# EAGLE design Booster Capacitor (EAGLE 9.6.2)
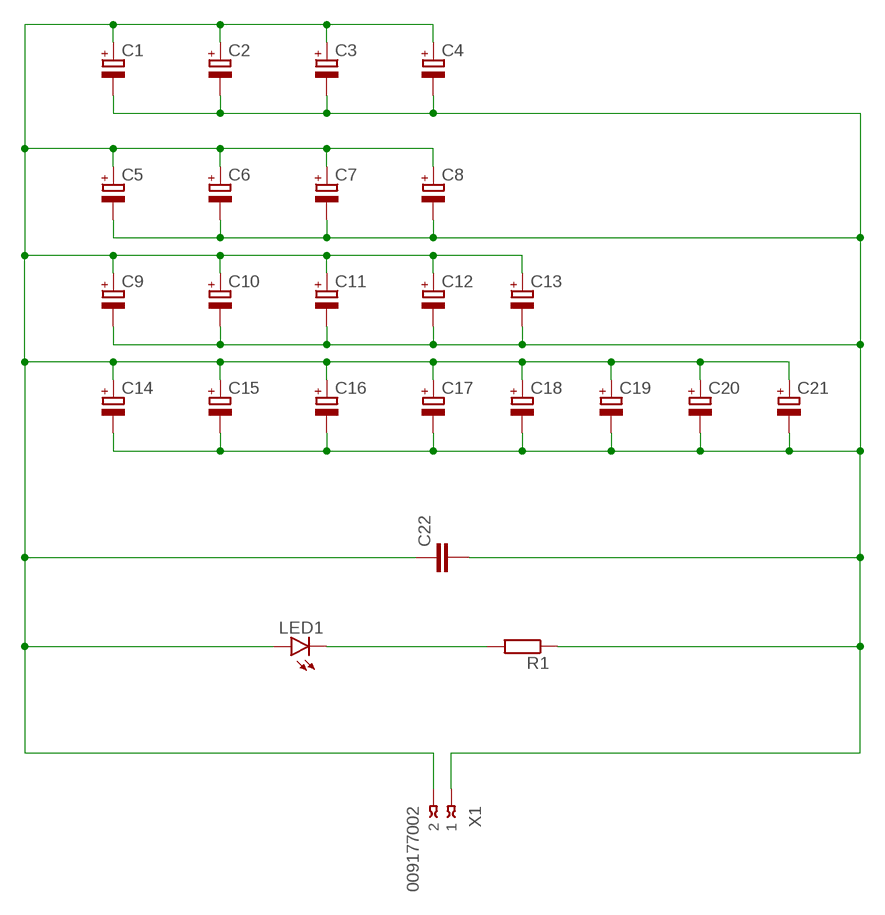
[diagram p0: schematic, sheet 1]

## Parts
C1  CPOL-EUE3.5-8  [E3,5-8]
C2  CPOL-EUE3.5-8  [E3,5-8]
C3  CPOL-EUE3.5-8  [E3,5-8]
C4  CPOL-EUE3.5-8  [E3,5-8]
C5  CPOL-EUE3.5-8  [E3,5-8]
C6  CPOL-EUE3.5-8  [E3,5-8]
C7  CPOL-EUE3.5-8  [E3,5-8]
C8  CPOL-EUE3.5-8  [E3,5-8]
C9  CPOL-EUE2.5-7  [E2,5-7]
C10  CPOL-EUE2.5-7  [E2,5-7]
C11  CPOL-EUE2.5-7  [E2,5-7]
C12  CPOL-EUE2.5-7  [E2,5-7]
C13  CPOL-EUE2.5-7  [E2,5-7]
C14  CPOL-EUE2.5-6  [E2,5-6]
C15  CPOL-EUE2.5-6  [E2,5-6]
C16  CPOL-EUE2.5-6  [E2,5-6]
C17  CPOL-EUE2.5-6  [E2,5-6]
C18  CPOL-EUE2.5-6  [E2,5-6]
C19  CPOL-EUE2.5-6  [E2,5-6]
C20  CPOL-EUE2.5-6  [E2,5-6]
C21  CPOL-EUE2.5-6  [E2,5-6]
C22  C-EU025-025X050  [C025-025X050]
LED1  LED5MM  [LED5MM]
R1  R-EU_0207/10  [0207/10]
X1  009177002  [009177002]

## Nets
N$1: LED1.K(C) R1.2
N$4: C1.+ C2.+ C3.+ C4.+ C5.+ C6.+ C7.+ C8.+ C9.+ C10.+ C11.+ C12.+ C13.+ C14.+ C15.+ C16.+ C17.+ C18.+ C19.+ C20.+ C21.+ C22.1 LED1.A X1.2
N$7: C1.- C2.- C3.- C4.- C5.- C6.- C7.- C8.- C9.- C10.- C11.- C12.- C13.- C14.- C15.- C16.- C17.- C18.- C19.- C20.- C21.- C22.2 R1.1 X1.1

## Library data of the parts
C1-C21 = rcl:CPOL-EU: POLARIZED CAPACITOR, European symbol; SPICEPREFIX: C
C22 = rcl:C-EU: CAPACITOR, European symbol; SPICEPREFIX: C
LED1 = led:LED: LED OSRAM: - CHIPLED LG R971, LG N971, LY N971, LG Q971, LY Q971, LO R971, LY R971 LH N974, LH R974 LS Q976, LO Q976, LY Q976 LO Q996 - Hyper CHIPLED LW Q18S LB Q993, LB Q99A, LB R99A - SideLED LS A670, LO A670, LY A670, LG A670, LP A670 LB A673, LV A673, LT A673, LW A673 LH A674 LY A675 LS A676, LA A676, LO A676, LY A676, LW A676 LS A679, LY A679, LG A679 - Hyper Micro SIDELED® LS Y876, LA Y876, LO Y876, LY Y876 LT Y87S - SmartLED LW L88C, LW L88S LB L89C, LB L89S, LG L890 LS L89K, LO L89K, LY L89K LS L896, LA L896, LO L896, LY L896 - TOPLED LS T670, LO T670, LY T670, LG T670, LP T670 LSG T670, LSP T670, LSY T670, LOP T670, LYG T670 LG T671, LOG T671, LSG T671 LB T673, LV T673, LT T673, LW T673 LH T674 LS T676, LA T676, LO T676, LY T676, LB T676, LH T676, LSB T676, LW T676 LB T67C, LV T67C, LT T67C, LS T67K, LO T67K, LY T67K, LW E67C LS E67B, LA E67B, LO E67B, LY E67B, LB E67C, LV E67C, LT E67C LW T67C LS T679, LY T679, LG T679 LS T770, LO T770, LY T770, LG T770, LP T770 LB T773, LV T773, LT T773, LW T773 LH T774 LS E675, LA E675, LY E675, LS T675 LS T776, LA T776, LO T776, LY T776, LB T776 LHGB T686 LT T68C, LB T68C - Hyper Mini TOPLED® LB M676 - Mini TOPLED Santana® LG M470 LS M47K, LO M47K, LY M47K Source: http://www.osram.convergy.de LUXEON: - LUMILED® LXK2-PW12-R00, LXK2-PW12-S00, LXK2-PW14-U00, LXK2-PW14-V00 LXK2-PM12-R00, LXK2-PM12-S00, LXK2-PM14-U00 LXK2-PE12-Q00, LXK2-PE12-R00, LXK2-PE12-S00, LXK2-PE14-T00, LXK2-PE14-U00 LXK2-PB12-K00, LXK2-PB12-L00, LXK2-PB12-M00, LXK2-PB14-N00, LXK2-PB14-P00, LXK2-PB14-Q00 LXK2-PR12-L00, LXK2-PR12-M00, LXK2-PR14-Q00, LXK2-PR14-R00 LXK2-PD12-Q00, LXK2-PD12-R00, LXK2-PD12-S00 LXK2-PH12-R00, LXK2-PH12-S00 LXK2-PL12-P00, LXK2-PL12-Q00, LXK2-PL12-R00 Source: www.luxeon.com KINGBRIGHT: KA-3528ASYC Source: www.kingbright.com
R1 = rcl:R-EU_: RESISTOR, European symbol; SPICEPREFIX: R
X1 = con-avx:00917?002: Wire to Board Strip IDC Connector 2 WAY Source: http://www.avx.com/docs/Catalogs/9176.pdf http://www.avx.com/docs/Catalogs/9177.pdf; MPN: 009177002001006; OC_FARNELL: unknown; OC_NEWARK: 09P1124

## Board
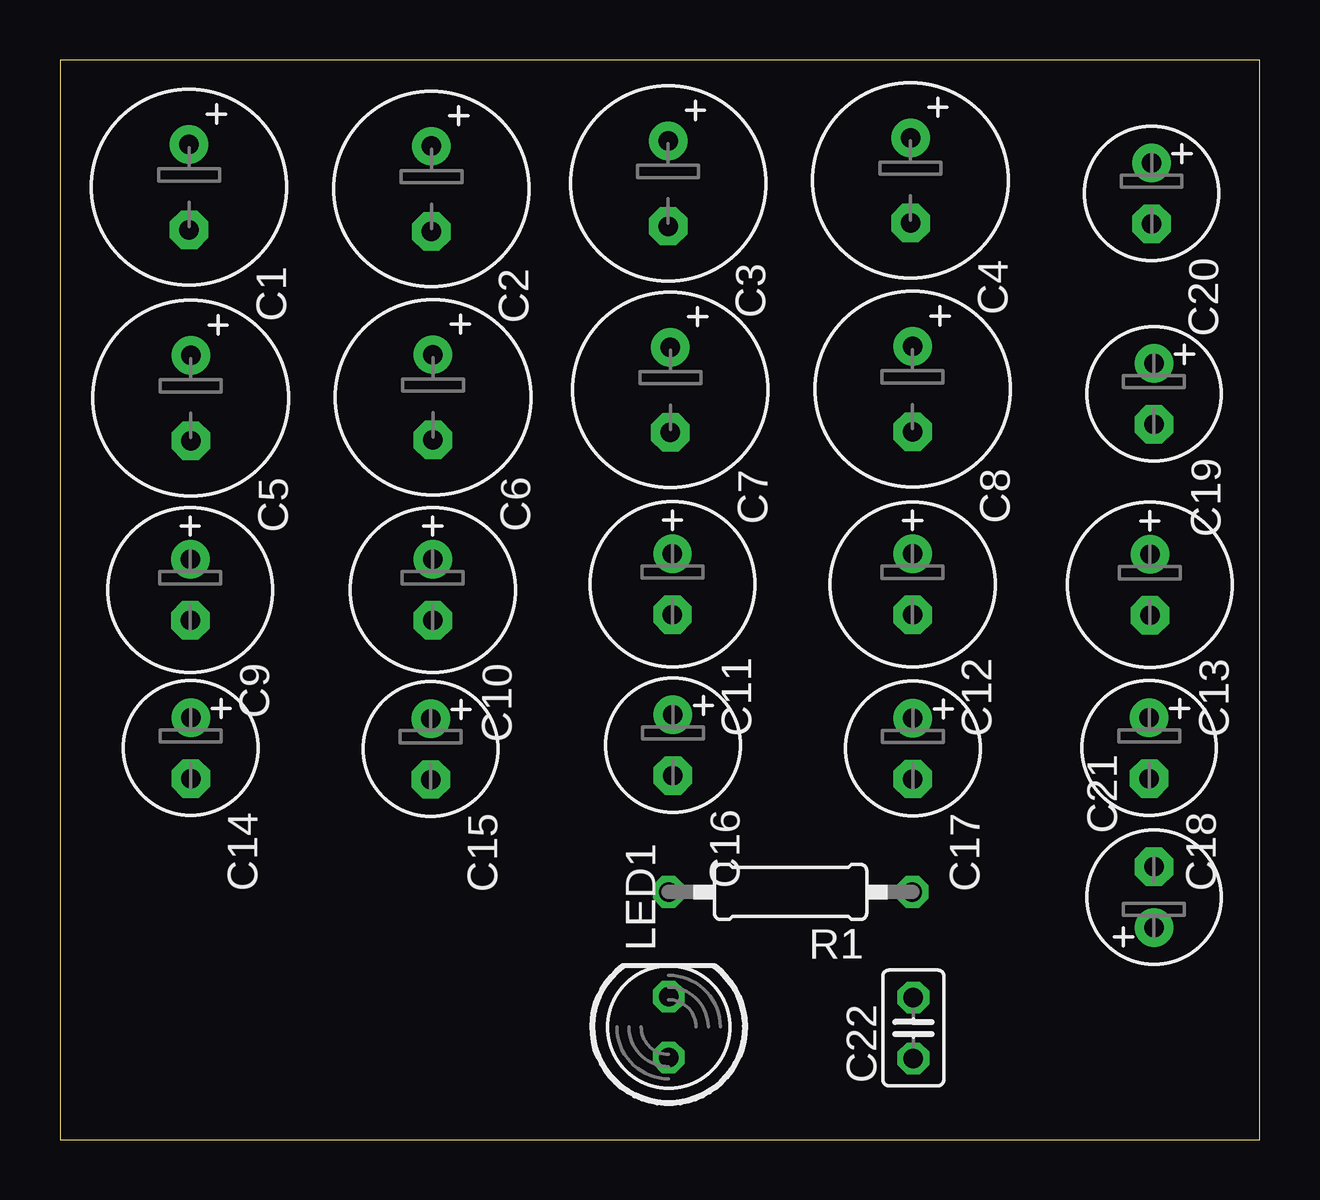
[diagram p1: board, top side]
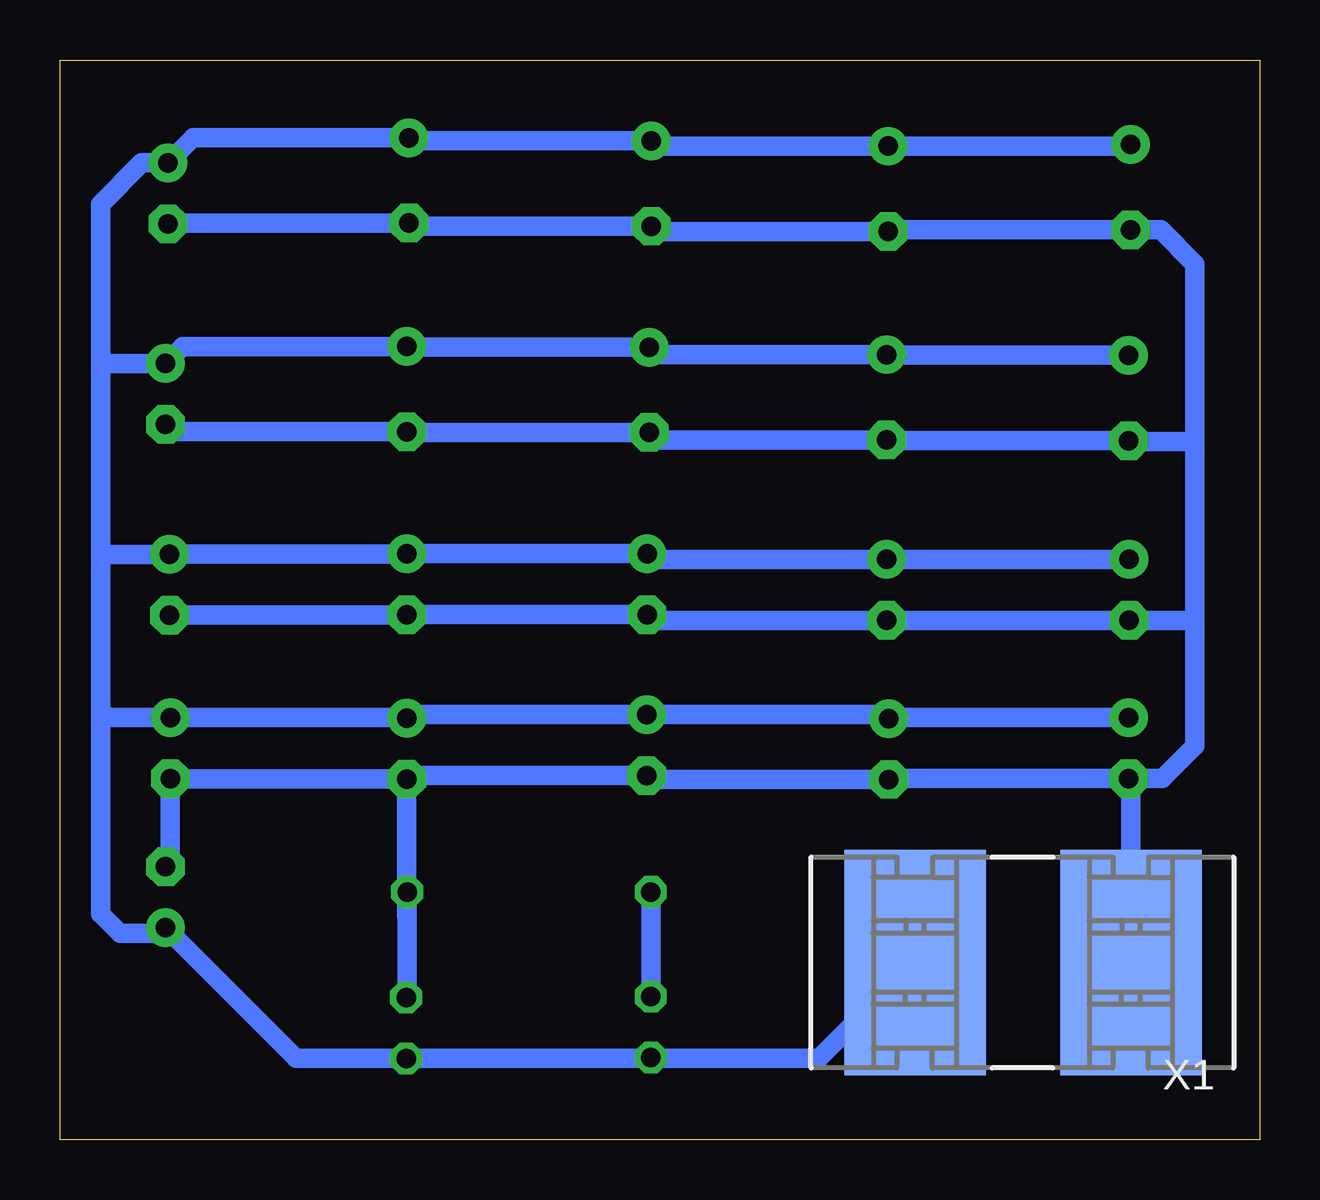
[diagram p2: board, bottom side, seen from below]

Size 50 x 45 mm. Coordinates in mm from the lower left corner, seen from the top.
Outline: 0,0 50,0 50,45 0,45 0,0
Copper layers (1*16): Top 0.035mm / dielectric 1.5mm / Bottom 0.035mm
Design rules "default": minimum track width 6mil, minimum drill 0.35mm, track to track 6mil, track to pad 6mil, pad to pad 6mil, via to via 6mil, smd to smd 6mil, copper to edge 40mil, drill to drill 6mil, minimum pad ring 10mil, minimum via ring 8mil, stop-mask expansion 4mil, vias tented up to drill 0mil, thermal gap 10mil

### Footprints (pad centres in the part's own frame; a part is rotated, then mirrored left to right if it is on the bottom)
E3,5-8 = drill 0.813 pad 1.6: + -1.778,0 | drill 0.813 pad 1.6 octagon: - 1.778,0
E2,5-7 = drill 0.813 pad 1.6: + -1.27,0 | drill 0.813 pad 1.6 octagon: - 1.27,0
E2,5-6 = drill 0.813 pad 1.6: + -1.27,0 | drill 0.813 pad 1.6 octagon: - 1.27,0
C025-025X050 = drill 0.813 octagon: 1 -1.27,0; 2 1.27,0
LED5MM = drill 0.813 octagon: A -1.27,0; K 1.27,0
0207/10 = drill 0.813 octagon: 1 -5.08,0; 2 5.08,0
009177002 = smd 5.9 x 9.4: 1 -4.5,0; 2 4.5,0

### Placement (x,y rotation side)
C1  5.38,39.7 270 top
C2  15.48,39.63 270 top
C3  25.35,39.85 270 top
C4  35.45,39.98 270 top
C5  5.45,30.91 270 top
C6  15.55,30.94 270 top
C7  25.44,31.25 270 top
C8  35.54,31.28 270 top
C9  5.43,22.91 270 top
C10  15.54,22.91 270 top
C11  25.53,23.15 270 top
C12  35.54,23.14 270 top
C13  45.43,23.12 270 top
C14  5.45,16.32 270 top
C15  15.45,16.28 270 top
C16  25.55,16.44 270 top
C17  35.55,16.3 270 top
C18  45.4,16.32 270 top
C19  45.6,31.08 270 top
C20  45.5,39.44 270 top
C21  45.6,10.1 90 top
C22  35.57,4.65 90 top
LED1  25.37,4.69 90 top
R1  30.45,10.32 180 top
X1  9.86,7.38 180 bottom

### Tracks (layer width: path | path; a pad name or v marks a point on that pad's centre or on a via)
N$1
  Bottom 0.813: R1.2 LED1.K
N$4
  Bottom 0.813: C1.+ 5.45,41.41 C2.+ 25.13,41.41 C3.+ 35.32,41.63 C4.+ 44.45,41.76 C20.+ 46.59,40.71 48.3,39 48.3,32.35 | C9.+ C10.+ 25.29,24.18 C11.+ C12.+ 45.41,24.41 C13.+ 48.19,24.39 48.3,24.5 | C14.+ 15.41,17.59 C15.+ 15.61,17.71 C16.+ 35.41,17.71 C17.+ 35.57,17.59 C18.+ 47.99,17.59 48.3,17.9 | 48.3,32.35 C19.+ 44.89,33.06 C8.+ 35.51,33.03 C7.+ 25.13,32.72 C6.+ 15.52,32.69 C5.+ | 48.3,17.9 48.3,9.4 47.5,8.6 45.83,8.6 C21.+ 40.15,3.38 C22.1 25.41,3.38 | 25.41,3.38 LED1.A | X1.2 18.36,3.38 25.41,3.38 | 48.3,24.5 48.3,32.35 | 48.3,17.9 48.3,24.5
N$7
  Bottom 0.813: C14.- 15.41,15.05 C15.- 25.39,15.01 C16.- 35.41,15.17 C17.- | C17.- 45.38,15.03 C18.- 45.4,11.57 C21.- | C20.- 45.47,38.2 C4.- 35.32,38.07 C3.- 25.13,37.85 C2.- 15.41,37.92 C1.- 4.12,37.92 2.7,36.5 2.7,29.3 | C19.- 45.29,29.5 C8.- 35.51,29.47 C7.- 25.13,29.16 C6.- 15.52,29.13 C5.- 5.42,29.1 2.9,29.1 2.7,29.3 | C13.- 45.41,21.87 C12.- C11.- 25.29,21.64 C10.- C9.- 2.7,21.64 2.7,29.3 | 2.7,22.1 2.7,16.4 4.05,15.05 C14.- | C17.- 35.55,9.34 R1.1 35.53,5.96 C22.2 | X1.1 5.36,14.96 C14.-